# Altium schematic sheet Programmable Unijunction Transistor.schdoc: Programmable UJT
size A4; Organization: Altium Limited; Address1: L3, 12a Rodborough Rd; Address2: Frenchs Forest; Address3: NSW; Address4: Australia 2086; DocumentNumber: 1; SheetNumber: 1; SheetTotal: 1
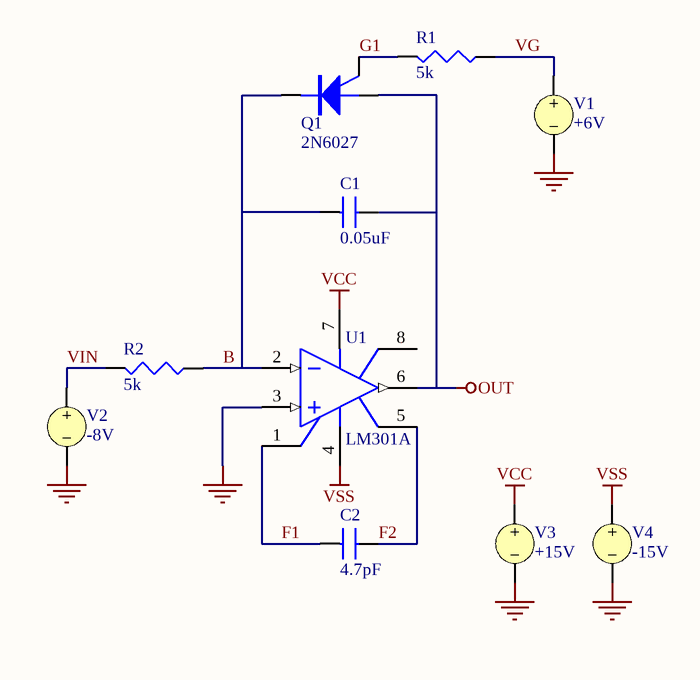
[diagram p0: Programmable Unijunction Transistor.schdoc]

## Parts
C1  0.05uF
C2  4.7pF
Q1  2N6027
R1  5k
R2  5k
U1  LM301A
V1  +6V
V2  -8V
V3  +15V
V4  -15V

## Nets
GND: U1.3(IN+) V1.2 V2.2 V3.2 V4.2
OUT: C1.2 Q1.1(A) U1.6(OUT)
VCC: U1.7(VCC) V3.1
VSS: U1.4(VSS) V4.1
B: C1.1 Q1.3(K) R2.2(BOT) U1.2(IN-)
F1: C2.1 U1.1(N1/CMP)
F2: C2.2 U1.5(N2/CMP)
G1: Q1.2(G) R1.1(TOP)
VG: R1.2(BOT) V1.1
VIN: R2.1(TOP) V2.1

Not connected (* = marked no-connect by the designer): U1 8(FREQ_COMP)

## Notes on the sheet
- Title
- Size:
- Date:
- A4
- Number:
- Time:
- Revision:
- Sheet
- of
- File:

## Library data of the parts
C1 C2 = CAP: Capacitor
  C1: Value: 0.05uF
  C2: Value: 4.7pF
Q1 = 2N6027: Programmable Unijunction Transistor
R1 R2 = RES: Resistor; Value: 5k
U1 = LM301A: Operational Amplifier
V1-V4 = VSRC: Voltage Source
  V1: Value: +6V
  V2: Value: -8V
  V3: Value: +15V
  V4: Value: -15V